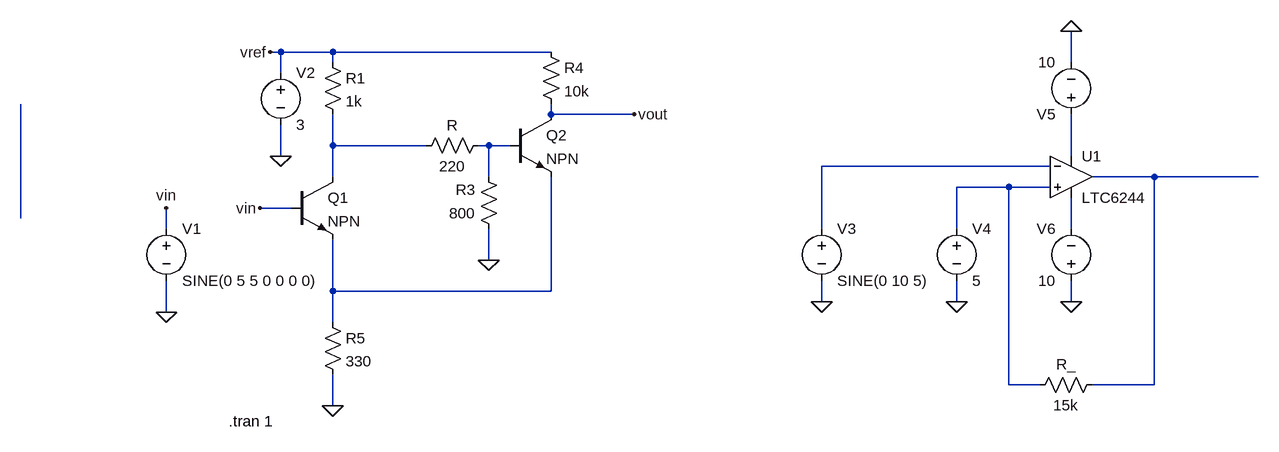
[diagram p0: schematic schmitt_triggers.asc]
schmitt_triggers.asc, the LTspice schematic file:
Version 4
SHEET 1 1492 680
WIRE -16 80 -32 80
WIRE 64 80 -16 80
WIRE 400 80 64 80
WIRE 64 96 64 80
WIRE 1200 96 1200 48
WIRE -16 112 -16 80
WIRE 400 176 400 160
WIRE 528 176 400 176
WIRE 64 224 64 176
WIRE 208 224 64 224
WIRE 304 224 288 224
WIRE 336 224 304 224
WIRE -16 240 -16 192
WIRE 1200 240 1200 176
WIRE 1168 256 816 256
WIRE 64 272 64 224
WIRE 304 272 304 224
WIRE 1328 272 1232 272
WIRE 1488 272 1328 272
WIRE 1104 288 1024 288
WIRE 1168 288 1104 288
WIRE 0 320 -48 320
WIRE -416 336 -416 160
WIRE -192 352 -192 320
WIRE 816 352 816 256
WIRE 1024 352 1024 288
WIRE 1200 352 1200 304
WIRE 304 400 304 352
WIRE 64 448 64 368
WIRE 400 448 400 272
WIRE 400 448 64 448
WIRE 816 464 816 432
WIRE 1024 464 1024 432
WIRE 1200 464 1200 432
WIRE -192 480 -192 432
WIRE 64 496 64 448
WIRE 1104 592 1104 288
WIRE 1152 592 1104 592
WIRE 1328 592 1328 272
WIRE 1328 592 1232 592
WIRE 64 624 64 576
FLAG -32 80 vref
FLAG -48 320 vin
FLAG 528 176 vout
FLAG 304 400 0
FLAG 64 624 0
FLAG -192 320 vin
FLAG -192 480 0
FLAG -16 240 0
FLAG 1200 48 0
FLAG 816 464 0
FLAG 1024 464 0
FLAG 1200 464 0
SYMBOL res 48 80 R0
SYMATTR InstName R1
SYMATTR Value 1k
SYMBOL res 304 208 R90
WINDOW 0 0 56 VBottom 2
WINDOW 3 32 56 VTop 2
SYMATTR InstName R
SYMATTR Value 220
SYMBOL res 320 368 R180
WINDOW 0 36 76 Left 2
WINDOW 3 36 40 Left 2
SYMATTR InstName R3
SYMATTR Value 800
SYMBOL res 384 64 R0
SYMATTR InstName R4
SYMATTR Value 10k
SYMBOL res 48 480 R0
SYMATTR InstName R5
SYMATTR Value 330
SYMBOL npn 0 272 R0
SYMATTR InstName Q1
SYMBOL npn 336 176 R0
SYMATTR InstName Q2
SYMBOL voltage -192 336 R0
WINDOW 123 0 0 Left 0
WINDOW 39 0 0 Left 0
SYMATTR InstName V1
SYMATTR Value SINE(0 5 5 0 0 0 0)
SYMBOL voltage -16 96 R0
WINDOW 123 0 0 Left 0
WINDOW 39 0 0 Left 0
SYMATTR InstName V2
SYMATTR Value 3
SYMBOL voltage 816 336 R0
WINDOW 123 0 0 Left 0
WINDOW 39 0 0 Left 0
SYMATTR InstName V3
SYMATTR Value SINE(0 10 5)
SYMBOL OpAmps\\LTC6244 1200 272 R0
SYMATTR InstName U1
SYMBOL voltage 1024 336 R0
WINDOW 123 0 0 Left 0
WINDOW 39 0 0 Left 0
SYMATTR InstName V4
SYMATTR Value 5
SYMBOL voltage 1200 192 R180
WINDOW 123 0 0 Left 0
WINDOW 39 0 0 Left 0
SYMATTR InstName V5
SYMATTR Value 10
SYMBOL voltage 1200 448 R180
WINDOW 0 24 96 Left 2
WINDOW 3 24 16 Left 2
WINDOW 123 0 0 Left 0
WINDOW 39 0 0 Left 0
SYMATTR InstName V6
SYMATTR Value 10
SYMBOL res 1248 576 R90
WINDOW 0 0 56 VBottom 2
WINDOW 3 32 56 VTop 2
SYMATTR InstName R_
SYMATTR Value 15k
TEXT -96 648 Left 2 !.tran 1

The netlist it stands for:
* schmitt_triggers.asc
R1 vref N001 1k
R N002 N001 220
R3 0 N002 800
R4 vref vout 10k
R5 N009 0 330
Q1 N001 vin N009 0 NPN
Q2 vout N002 N009 0 NPN
V1 vin 0 SINE(0 5 5 0 0 0 0)
V2 vref 0 3
V3 N004 0 SINE(0 10 5)
XU1 N006 N004 N003 N008 N005 LTC6244  ; pins In+ In- V+ V- OUT
V4 N006 0 5
V5 N003 0 10
V6 0 N008 10
R_ N005 N006 15k
.model NPN NPN
.model PNP PNP
.lib standard.bjt
.tran 1
.backanno
.end